# EAGLE design Wordwatch - complete (EAGLE 8.0.1)
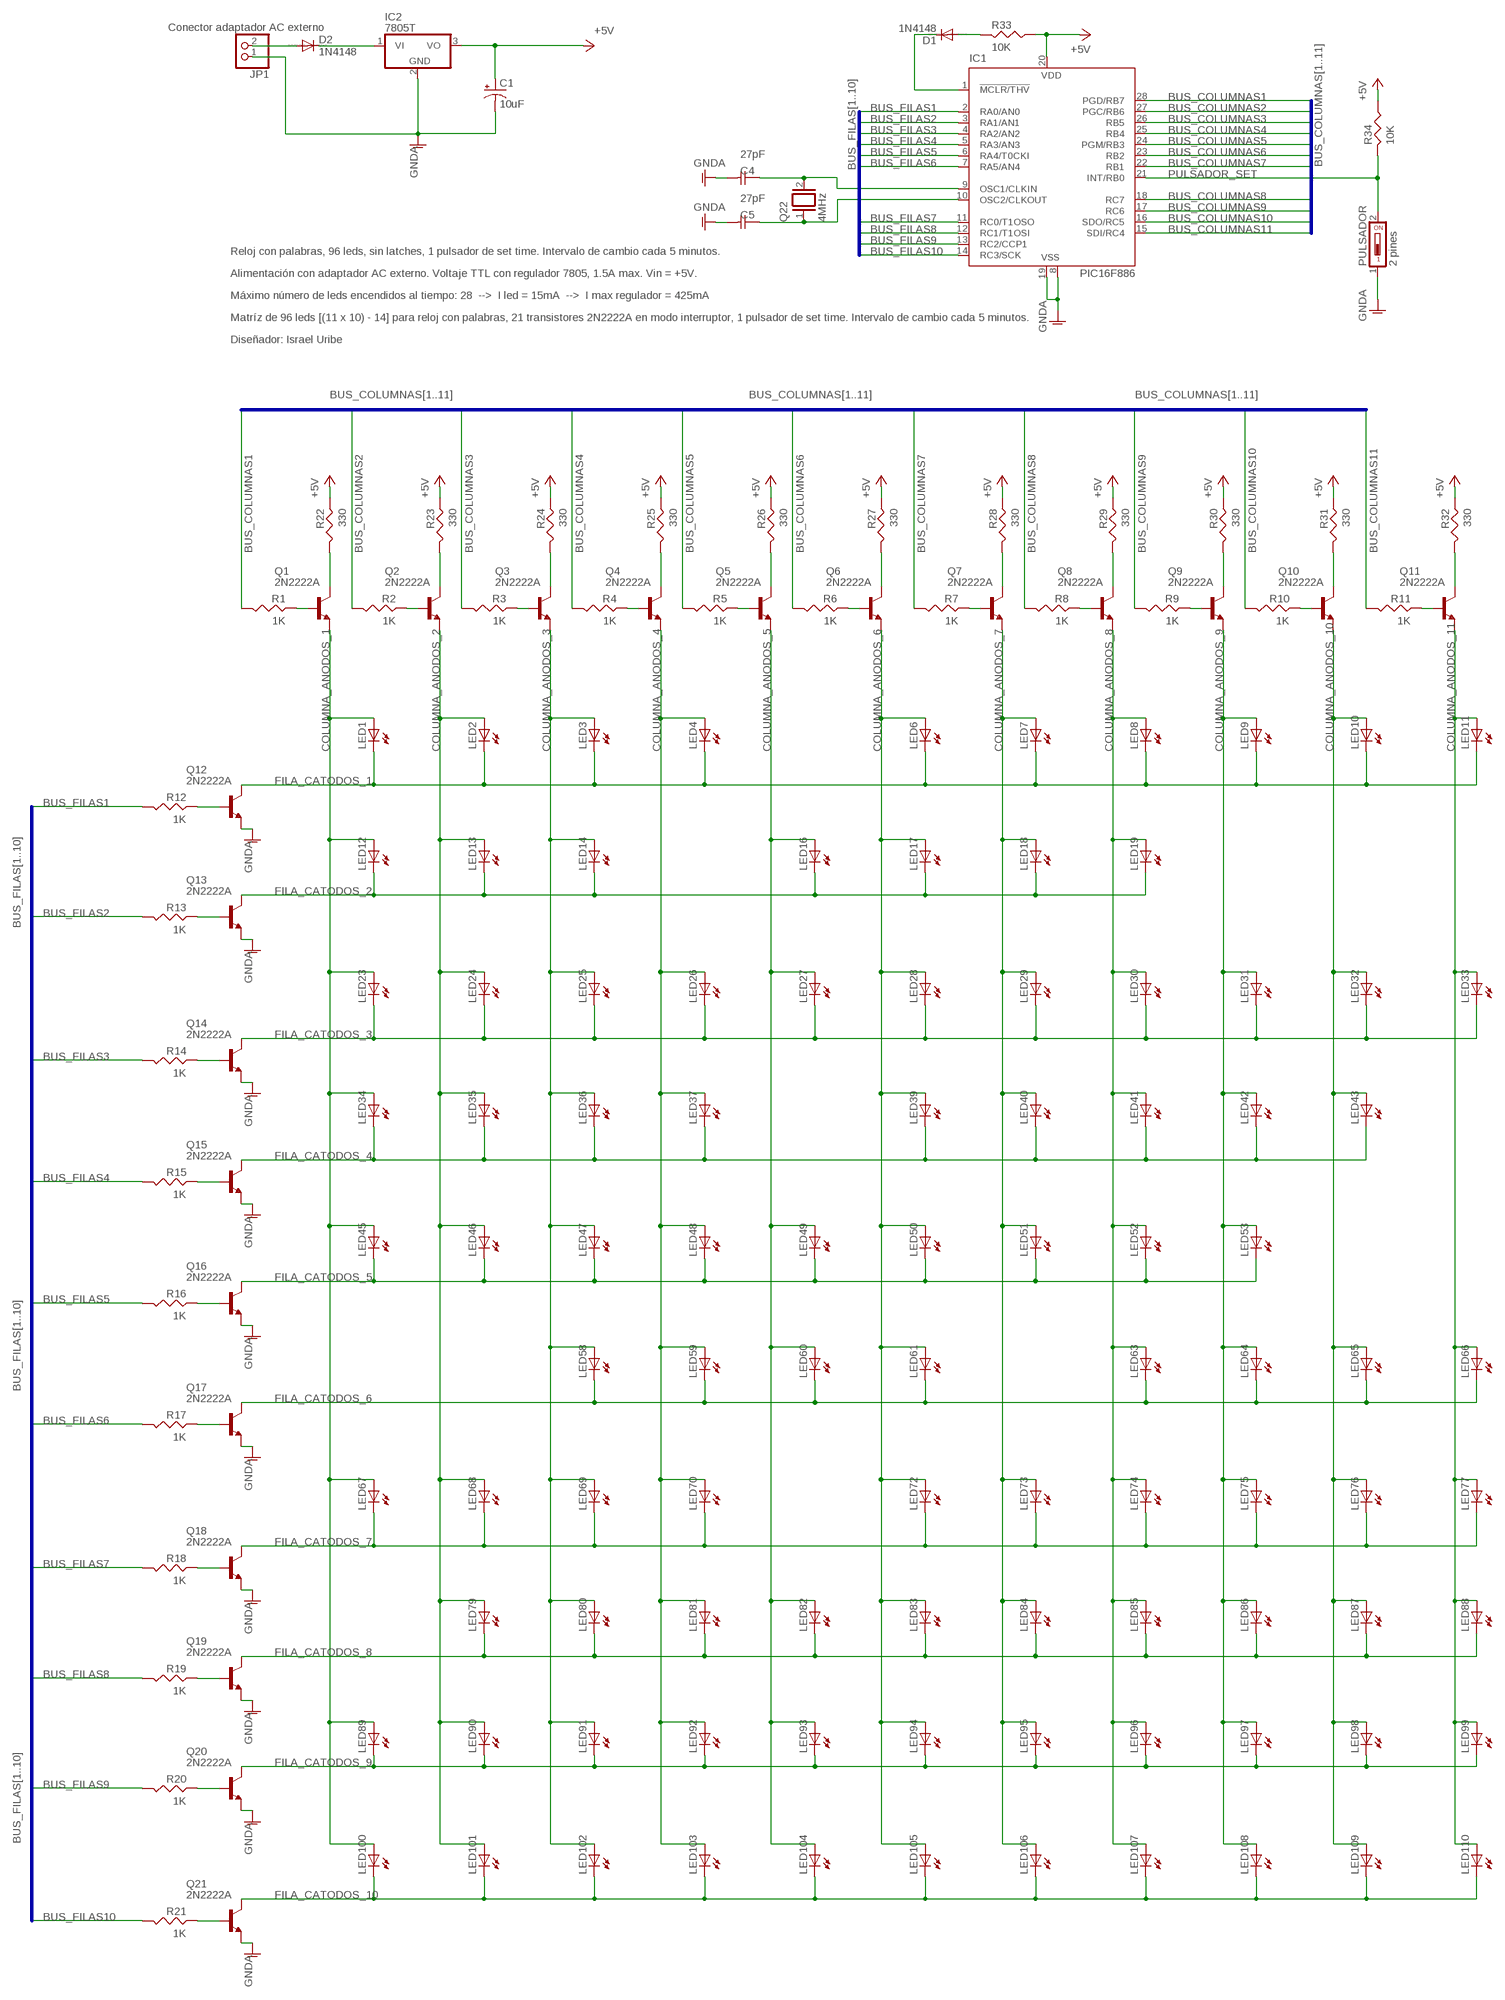
[diagram p0: schematic, sheet 1]

## Parts
C1  10uF  CPOL-USE2-4  [E2-4]
C4  27pF  CAPNP-2,5  [C-2,5]
C5  27pF  CAPNP-2,5  [C-2,5]
D1  1N4148  DIODE-D-7.5  [D-7.5]
D2  1N4148  DIODE-D-7.5  [D-7.5]
IC1  PIC16F886  PIC16876P  [DIL28-3]
IC2  7805T  [TO220H]
JP1  Conector adaptador AC externo  PINHD-1X2  [1X02]
LED1  LED3MM  [LED3MM]
LED2  LED3MM  [LED3MM]
LED3  LED3MM  [LED3MM]
LED4  LED3MM  [LED3MM]
LED6  LED3MM  [LED3MM]
LED7  LED3MM  [LED3MM]
LED8  LED3MM  [LED3MM]
LED9  LED3MM  [LED3MM]
LED10  LED3MM  [LED3MM]
LED11  LED3MM  [LED3MM]
LED12  LED3MM  [LED3MM]
LED13  LED3MM  [LED3MM]
LED14  LED3MM  [LED3MM]
LED16  LED3MM  [LED3MM]
LED17  LED3MM  [LED3MM]
LED18  LED3MM  [LED3MM]
LED19  LED3MM  [LED3MM]
LED23  LED3MM  [LED3MM]
LED24  LED3MM  [LED3MM]
LED25  LED3MM  [LED3MM]
LED26  LED3MM  [LED3MM]
LED27  LED3MM  [LED3MM]
LED28  LED3MM  [LED3MM]
LED29  LED3MM  [LED3MM]
LED30  LED3MM  [LED3MM]
LED31  LED3MM  [LED3MM]
LED32  LED3MM  [LED3MM]
LED33  LED3MM  [LED3MM]
LED34  LED3MM  [LED3MM]
LED35  LED3MM  [LED3MM]
LED36  LED3MM  [LED3MM]
LED37  LED3MM  [LED3MM]
LED39  LED3MM  [LED3MM]
LED40  LED3MM  [LED3MM]
LED41  LED3MM  [LED3MM]
LED42  LED3MM  [LED3MM]
LED43  LED3MM  [LED3MM]
LED45  LED3MM  [LED3MM]
LED46  LED3MM  [LED3MM]
LED47  LED3MM  [LED3MM]
LED48  LED3MM  [LED3MM]
LED49  LED3MM  [LED3MM]
LED50  LED3MM  [LED3MM]
LED51  LED3MM  [LED3MM]
LED52  LED3MM  [LED3MM]
LED53  LED3MM  [LED3MM]
LED58  LED3MM  [LED3MM]
LED59  LED3MM  [LED3MM]
LED60  LED3MM  [LED3MM]
LED61  LED3MM  [LED3MM]
LED63  LED3MM  [LED3MM]
LED64  LED3MM  [LED3MM]
LED65  LED3MM  [LED3MM]
LED66  LED3MM  [LED3MM]
LED67  LED3MM  [LED3MM]
LED68  LED3MM  [LED3MM]
LED69  LED3MM  [LED3MM]
LED70  LED3MM  [LED3MM]
LED72  LED3MM  [LED3MM]
LED73  LED3MM  [LED3MM]
LED74  LED3MM  [LED3MM]
LED75  LED3MM  [LED3MM]
LED76  LED3MM  [LED3MM]
LED77  LED3MM  [LED3MM]
LED79  LED3MM  [LED3MM]
LED80  LED3MM  [LED3MM]
LED81  LED3MM  [LED3MM]
LED82  LED3MM  [LED3MM]
LED83  LED3MM  [LED3MM]
LED84  LED3MM  [LED3MM]
LED85  LED3MM  [LED3MM]
LED86  LED3MM  [LED3MM]
LED87  LED3MM  [LED3MM]
LED88  LED3MM  [LED3MM]
LED89  LED3MM  [LED3MM]
LED90  LED3MM  [LED3MM]
LED91  LED3MM  [LED3MM]
LED92  LED3MM  [LED3MM]
LED93  LED3MM  [LED3MM]
LED94  LED3MM  [LED3MM]
LED95  LED3MM  [LED3MM]
LED96  LED3MM  [LED3MM]
LED97  LED3MM  [LED3MM]
LED98  LED3MM  [LED3MM]
LED99  LED3MM  [LED3MM]
LED100  LED3MM  [LED3MM]
LED101  LED3MM  [LED3MM]
LED102  LED3MM  [LED3MM]
LED103  LED3MM  [LED3MM]
LED104  LED3MM  [LED3MM]
LED105  LED3MM  [LED3MM]
LED106  LED3MM  [LED3MM]
LED107  LED3MM  [LED3MM]
LED108  LED3MM  [LED3MM]
LED109  LED3MM  [LED3MM]
LED110  LED3MM  [LED3MM]
PULSADOR  2 pines  DS01  [DS-01]
Q1  2N2222A  2N4124-NPN-TO92-CBE  [TO92-CBE]
Q2  2N2222A  2N4124-NPN-TO92-CBE  [TO92-CBE]
Q3  2N2222A  2N4124-NPN-TO92-CBE  [TO92-CBE]
Q4  2N2222A  2N4124-NPN-TO92-CBE  [TO92-CBE]
Q5  2N2222A  2N4124-NPN-TO92-CBE  [TO92-CBE]
Q6  2N2222A  2N4124-NPN-TO92-CBE  [TO92-CBE]
Q7  2N2222A  2N4124-NPN-TO92-CBE  [TO92-CBE]
Q8  2N2222A  2N4124-NPN-TO92-CBE  [TO92-CBE]
Q9  2N2222A  2N4124-NPN-TO92-CBE  [TO92-CBE]
Q10  2N2222A  2N4124-NPN-TO92-CBE  [TO92-CBE]
Q11  2N2222A  2N4124-NPN-TO92-CBE  [TO92-CBE]
Q12  2N2222A  2N4124-NPN-TO92-CBE  [TO92-CBE]
Q13  2N2222A  2N4124-NPN-TO92-CBE  [TO92-CBE]
Q14  2N2222A  2N4124-NPN-TO92-CBE  [TO92-CBE]
Q15  2N2222A  2N4124-NPN-TO92-CBE  [TO92-CBE]
Q16  2N2222A  2N4124-NPN-TO92-CBE  [TO92-CBE]
Q17  2N2222A  2N4124-NPN-TO92-CBE  [TO92-CBE]
Q18  2N2222A  2N4124-NPN-TO92-CBE  [TO92-CBE]
Q19  2N2222A  2N4124-NPN-TO92-CBE  [TO92-CBE]
Q20  2N2222A  2N4124-NPN-TO92-CBE  [TO92-CBE]
Q21  2N2222A  2N4124-NPN-TO92-CBE  [TO92-CBE]
Q22  4MHz  XTAL/S  [QS]
R1  1K  RESUS-5  [R-5]
R2  1K  RESUS-5  [R-5]
R3  1K  RESUS-5  [R-5]
R4  1K  RESUS-5  [R-5]
R5  1K  RESUS-5  [R-5]
R6  1K  RESUS-5  [R-5]
R7  1K  RESUS-5  [R-5]
R8  1K  RESUS-5  [R-5]
R9  1K  RESUS-5  [R-5]
R10  1K  RESUS-5  [R-5]
R11  1K  RESUS-5  [R-5]
R12  1K  RESUS-5  [R-5]
R13  1K  RESUS-5  [R-5]
R14  1K  RESUS-5  [R-5]
R15  1K  RESUS-5  [R-5]
R16  1K  RESUS-5  [R-5]
R17  1K  RESUS-5  [R-5]
R18  1K  RESUS-5  [R-5]
R19  1K  RESUS-5  [R-5]
R20  1K  RESUS-5  [R-5]
R21  1K  RESUS-5  [R-5]
R22  330  RESUS-5  [R-5]
R23  330  RESUS-5  [R-5]
R24  330  RESUS-5  [R-5]
R25  330  RESUS-5  [R-5]
R26  330  RESUS-5  [R-5]
R27  330  RESUS-5  [R-5]
R28  330  RESUS-5  [R-5]
R29  330  RESUS-5  [R-5]
R30  330  RESUS-5  [R-5]
R31  330  RESUS-5  [R-5]
R32  330  RESUS-5  [R-5]
R33  10K  RESUS-5  [R-5]
R34  10K  RESUS-5  [R-5]

## Nets
+5V: C1.+ IC1.20(VDD) IC2.3(VO) R22.2 R23.2 R24.2 R25.2 R26.2 R27.2 R28.2 R29.2 R30.2 R31.2 R32.2 R33.1 R34.1
BUS_COLUMNAS1: IC1.28(PGD/RB7) R1.1
BUS_COLUMNAS2: IC1.27(PGC/RB6) R2.1
BUS_COLUMNAS3: IC1.26(RB5) R3.1
BUS_COLUMNAS4: IC1.25(RB4) R4.1
BUS_COLUMNAS5: IC1.24(PGM/RB3) R5.1
BUS_COLUMNAS6: IC1.23(RB2) R6.1
BUS_COLUMNAS7: IC1.22(RB1) R7.1
BUS_COLUMNAS8: IC1.18(RC7) R8.1
BUS_COLUMNAS9: IC1.17(RC6) R9.1
BUS_COLUMNAS10: IC1.16(SDO/RC5) R10.1
BUS_COLUMNAS11: IC1.15(SDI/RC4) R11.1
BUS_FILAS1: IC1.2(RA0/AN0) R12.1
BUS_FILAS2: IC1.3(RA1/AN1) R13.1
BUS_FILAS3: IC1.4(RA2/AN2) R14.1
BUS_FILAS4: IC1.5(RA3/AN3) R15.1
BUS_FILAS5: IC1.6(RA4/T0CKI) R16.1
BUS_FILAS6: IC1.7(RA5/AN4) R17.1
BUS_FILAS7: IC1.11(RC0/T1OSO) R18.1
BUS_FILAS8: IC1.12(RC1/T1OSI) R19.1
BUS_FILAS9: IC1.13(RC2/CCP1) R20.1
BUS_FILAS10: IC1.14(RC3/SCK) R21.1
COLUMNA_ANODOS_1: LED1.A LED12.A LED23.A LED34.A LED45.A LED67.A LED89.A LED100.A Q1.E
COLUMNA_ANODOS_2: LED2.A LED13.A LED24.A LED35.A LED46.A LED68.A LED79.A LED90.A LED101.A Q2.E
COLUMNA_ANODOS_3: LED3.A LED14.A LED25.A LED36.A LED47.A LED58.A LED69.A LED80.A LED91.A LED102.A Q3.E
COLUMNA_ANODOS_4: LED4.A LED26.A LED37.A LED48.A LED59.A LED70.A LED81.A LED92.A LED103.A Q4.E
COLUMNA_ANODOS_5: LED16.A LED27.A LED49.A LED60.A LED82.A LED93.A LED104.A Q5.E
COLUMNA_ANODOS_6: LED6.A LED17.A LED28.A LED39.A LED50.A LED61.A LED72.A LED83.A LED94.A LED105.A Q6.E
COLUMNA_ANODOS_7: LED7.A LED18.A LED29.A LED40.A LED51.A LED73.A LED84.A LED95.A LED106.A Q7.E
COLUMNA_ANODOS_8: LED8.A LED19.A LED30.A LED41.A LED52.A LED63.A LED74.A LED85.A LED96.A LED107.A Q8.E
COLUMNA_ANODOS_9: LED9.A LED31.A LED42.A LED53.A LED64.A LED75.A LED86.A LED97.A LED108.A Q9.E
COLUMNA_ANODOS_10: LED10.A LED32.A LED43.A LED65.A LED76.A LED87.A LED98.A LED109.A Q10.E
COLUMNA_ANODOS_11: LED11.A LED33.A LED66.A LED77.A LED88.A LED99.A LED110.A Q11.E
FILA_CATODOS_1: LED1.K(C) LED2.K(C) LED3.K(C) LED4.K(C) LED6.K(C) LED7.K(C) LED8.K(C) LED9.K(C) LED10.K(C) LED11.K(C) Q12.C
FILA_CATODOS_2: LED12.K(C) LED13.K(C) LED14.K(C) LED16.K(C) LED17.K(C) LED18.K(C) LED19.K(C) Q13.C
FILA_CATODOS_3: LED23.K(C) LED24.K(C) LED25.K(C) LED26.K(C) LED27.K(C) LED28.K(C) LED29.K(C) LED30.K(C) LED31.K(C) LED32.K(C) LED33.K(C) Q14.C
FILA_CATODOS_4: LED34.K(C) LED35.K(C) LED36.K(C) LED37.K(C) LED39.K(C) LED40.K(C) LED41.K(C) LED42.K(C) LED43.K(C) Q15.C
FILA_CATODOS_5: LED45.K(C) LED46.K(C) LED47.K(C) LED48.K(C) LED49.K(C) LED50.K(C) LED51.K(C) LED52.K(C) LED53.K(C) Q16.C
FILA_CATODOS_6: LED58.K(C) LED59.K(C) LED60.K(C) LED61.K(C) LED63.K(C) LED64.K(C) LED65.K(C) LED66.K(C) Q17.C
FILA_CATODOS_7: LED67.K(C) LED68.K(C) LED69.K(C) LED70.K(C) LED72.K(C) LED73.K(C) LED74.K(C) LED75.K(C) LED76.K(C) LED77.K(C) Q18.C
FILA_CATODOS_8: LED79.K(C) LED80.K(C) LED81.K(C) LED82.K(C) LED83.K(C) LED84.K(C) LED85.K(C) LED86.K(C) LED87.K(C) LED88.K(C) Q19.C
FILA_CATODOS_9: LED89.K(C) LED90.K(C) LED91.K(C) LED92.K(C) LED93.K(C) LED94.K(C) LED95.K(C) LED96.K(C) LED97.K(C) LED98.K(C) LED99.K(C) Q20.C
FILA_CATODOS_10: LED100.K(C) LED101.K(C) LED102.K(C) LED103.K(C) LED104.K(C) LED105.K(C) LED106.K(C) LED107.K(C) LED108.K(C) LED109.K(C) LED110.K(C) Q21.C
GNDA [ground]: C1.- C4.2 C5.2 IC1.8(VSS) IC1.19(VSS) IC2.2(GND) JP1.1 PULSADOR.1 Q12.E Q13.E Q14.E Q15.E Q16.E Q17.E Q18.E Q19.E Q20.E Q21.E
N$1: Q11.C R32.1
N$2: Q10.C R31.1
N$3: Q9.C R30.1
N$4: Q8.C R29.1
N$6: Q7.C R28.1
N$7: Q6.C R27.1
N$8: Q5.C R26.1
N$9: Q4.C R25.1
N$10: Q3.C R24.1
N$11: Q2.C R23.1
N$12: Q1.C R22.1
N$13: Q1.B R1.2
N$14: Q2.B R2.2
N$16: Q3.B R3.2
N$17: Q4.B R4.2
N$18: Q5.B R5.2
N$19: Q6.B R6.2
N$23: Q7.B R7.2
N$24: Q8.B R8.2
N$25: Q9.B R9.2
N$26: Q10.B R10.2
N$27: Q11.B R11.2
N$28: Q12.B R12.2
N$29: Q13.B R13.2
N$30: Q14.B R14.2
N$31: Q15.B R15.2
N$32: Q16.B R16.2
N$33: Q17.B R17.2
N$34: Q18.B R18.2
N$35: Q19.B R19.2
N$36: Q20.B R20.2
N$37: Q21.B R21.2
N$50: C4.1 IC1.9(OSC1/CLKIN) Q22.2
N$77: D1.A R33.2
N$78: C5.1 IC1.10(OSC2/CLKOUT) Q22.1
N$79: D1.C IC1.1(!MCLR/THV)
N$80: D2.A JP1.2
N$81: D2.C IC2.1(VI)
PULSADOR_SET: IC1.21(INT/RB0) PULSADOR.2 R34.2

## Buses
BUS_COLUMNAS[1..11]
BUS_FILAS[1..10]

## Notes on the sheet
- Reloj con palabras, 96 leds, sin latches, 1 pulsador de set time. Intervalo de cambio cada 5 minutos.
- Alimentación con adaptador AC externo. Voltaje TTL con regulador 7805, 1.5A max. Vin = +5V.
- Máximo número de leds encendidos al tiempo: 28  -->  I led = 15mA  -->  I max regulador = 425mA
- Matríz de 96 leds [(11 x 10) - 14] para reloj con palabras, 21 transistores 2N2222A en modo interruptor, 1 pulsador de set time. Intervalo de cambio cada 5 minutos.
- Diseñador: Israel Uribe

## Library data of the parts
C1 = rcl:CPOL-US: POLARIZED CAPACITOR, American symbol
C4 C5 = discrete:CAPNP-2,5
D1 D2 = diode:DIODE-: DIODE
IC1 = microchip:PIC16*876: MICROCONTROLLER flash type; OC_FARNELL: unknown; OC_NEWARK: unknown
IC2 = linear:78*: Positive VOLTAGE REGULATOR Source: http://cache.national.com/ds/LM/LM78L05.pdf http://www.fairchildsemi.com/ds/LM/LM7805.pdf
JP1 = pinhead:PINHD-1X2: PIN HEADER
LED1-LED4 LED6-LED14 LED16-LED19 LED23-LED37 LED39-LED43 LED45-LED53 LED58-LED61 LED63-LED70 LED72-LED77 LED79-LED110 = led:LED: LED OSRAM: - CHIPLED LG R971, LG N971, LY N971, LG Q971, LY Q971, LO R971, LY R971 LH N974, LH R974 LS Q976, LO Q976, LY Q976 LO Q996 - Hyper CHIPLED LW Q18S LB Q993, LB Q99A, LB R99A - SideLED LS A670, LO A670, LY A670, LG A670, LP A670 LB A673, LV A673, LT A673, LW A673 LH A674 LY A675 LS A676, LA A676, LO A676, LY A676, LW A676 LS A679, LY A679, LG A679 - Hyper Micro SIDELED® LS Y876, LA Y876, LO Y876, LY Y876 LT Y87S - SmartLED LW L88C, LW L88S LB L89C, LB L89S, LG L890 LS L89K, LO L89K, LY L89K LS L896, LA L896, LO L896, LY L896 - TOPLED LS T670, LO T670, LY T670, LG T670, LP T670 LSG T670, LSP T670, LSY T670, LOP T670, LYG T670 LG T671, LOG T671, LSG T671 LB T673, LV T673, LT T673, LW T673 LH T674 LS T676, LA T676, LO T676, LY T676, LB T676, LH T676, LSB T676, LW T676 LB T67C, LV T67C, LT T67C, LS T67K, LO T67K, LY T67K, LW E67C LS E67B, LA E67B, LO E67B, LY E67B, LB E67C, LV E67C, LT E67C LW T67C LS T679, LY T679, LG T679 LS T770, LO T770, LY T770, LG T770, LP T770 LB T773, LV T773, LT T773, LW T773 LH T774 LS E675, LA E675, LY E675, LS T675 LS T776, LA T776, LO T776, LY T776, LB T776 LHGB T686 LT T68C, LB T68C - Hyper Mini TOPLED® LB M676 - Mini TOPLED Santana® LG M470 LS M47K, LO M47K, LY M47K Source: http://www.osram.convergy.de LUXEON: - LUMILED® LXK2-PW12-R00, LXK2-PW12-S00, LXK2-PW14-U00, LXK2-PW14-V00 LXK2-PM12-R00, LXK2-PM12-S00, LXK2-PM14-U00 LXK2-PE12-Q00, LXK2-PE12-R00, LXK2-PE12-S00, LXK2-PE14-T00, LXK2-PE14-U00 LXK2-PB12-K00, LXK2-PB12-L00, LXK2-PB12-M00, LXK2-PB14-N00, LXK2-PB14-P00, LXK2-PB14-Q00 LXK2-PR12-L00, LXK2-PR12-M00, LXK2-PR14-Q00, LXK2-PR14-R00 LXK2-PD12-Q00, LXK2-PD12-R00, LXK2-PD12-S00 LXK2-PH12-R00, LXK2-PH12-S00 LXK2-PL12-P00, LXK2-PL12-Q00, LXK2-PL12-R00 Source: www.luxeon.com KINGBRIGHT: KA-3528ASYC Source: www.kingbright.com
PULSADOR = switch-dil:DS01: DIL/CODE SWITCH; OC_FARNELL: unknown; OC_NEWARK: unknown
Q1-Q21 = transistor:*-NPN-: NPN Transistror BF959 corrected 2008.03.06
Q22 = special:XTAL/S: CRYSTAL
R1-R34 = discrete:RESUS-5

## Net classes
0 default: width 3.048 mm, clearance 0.254 mm
1 ground: width 3.048 mm, clearance 0.254 mm
2 source: width 3.048 mm, clearance 0.254 mm

## Board
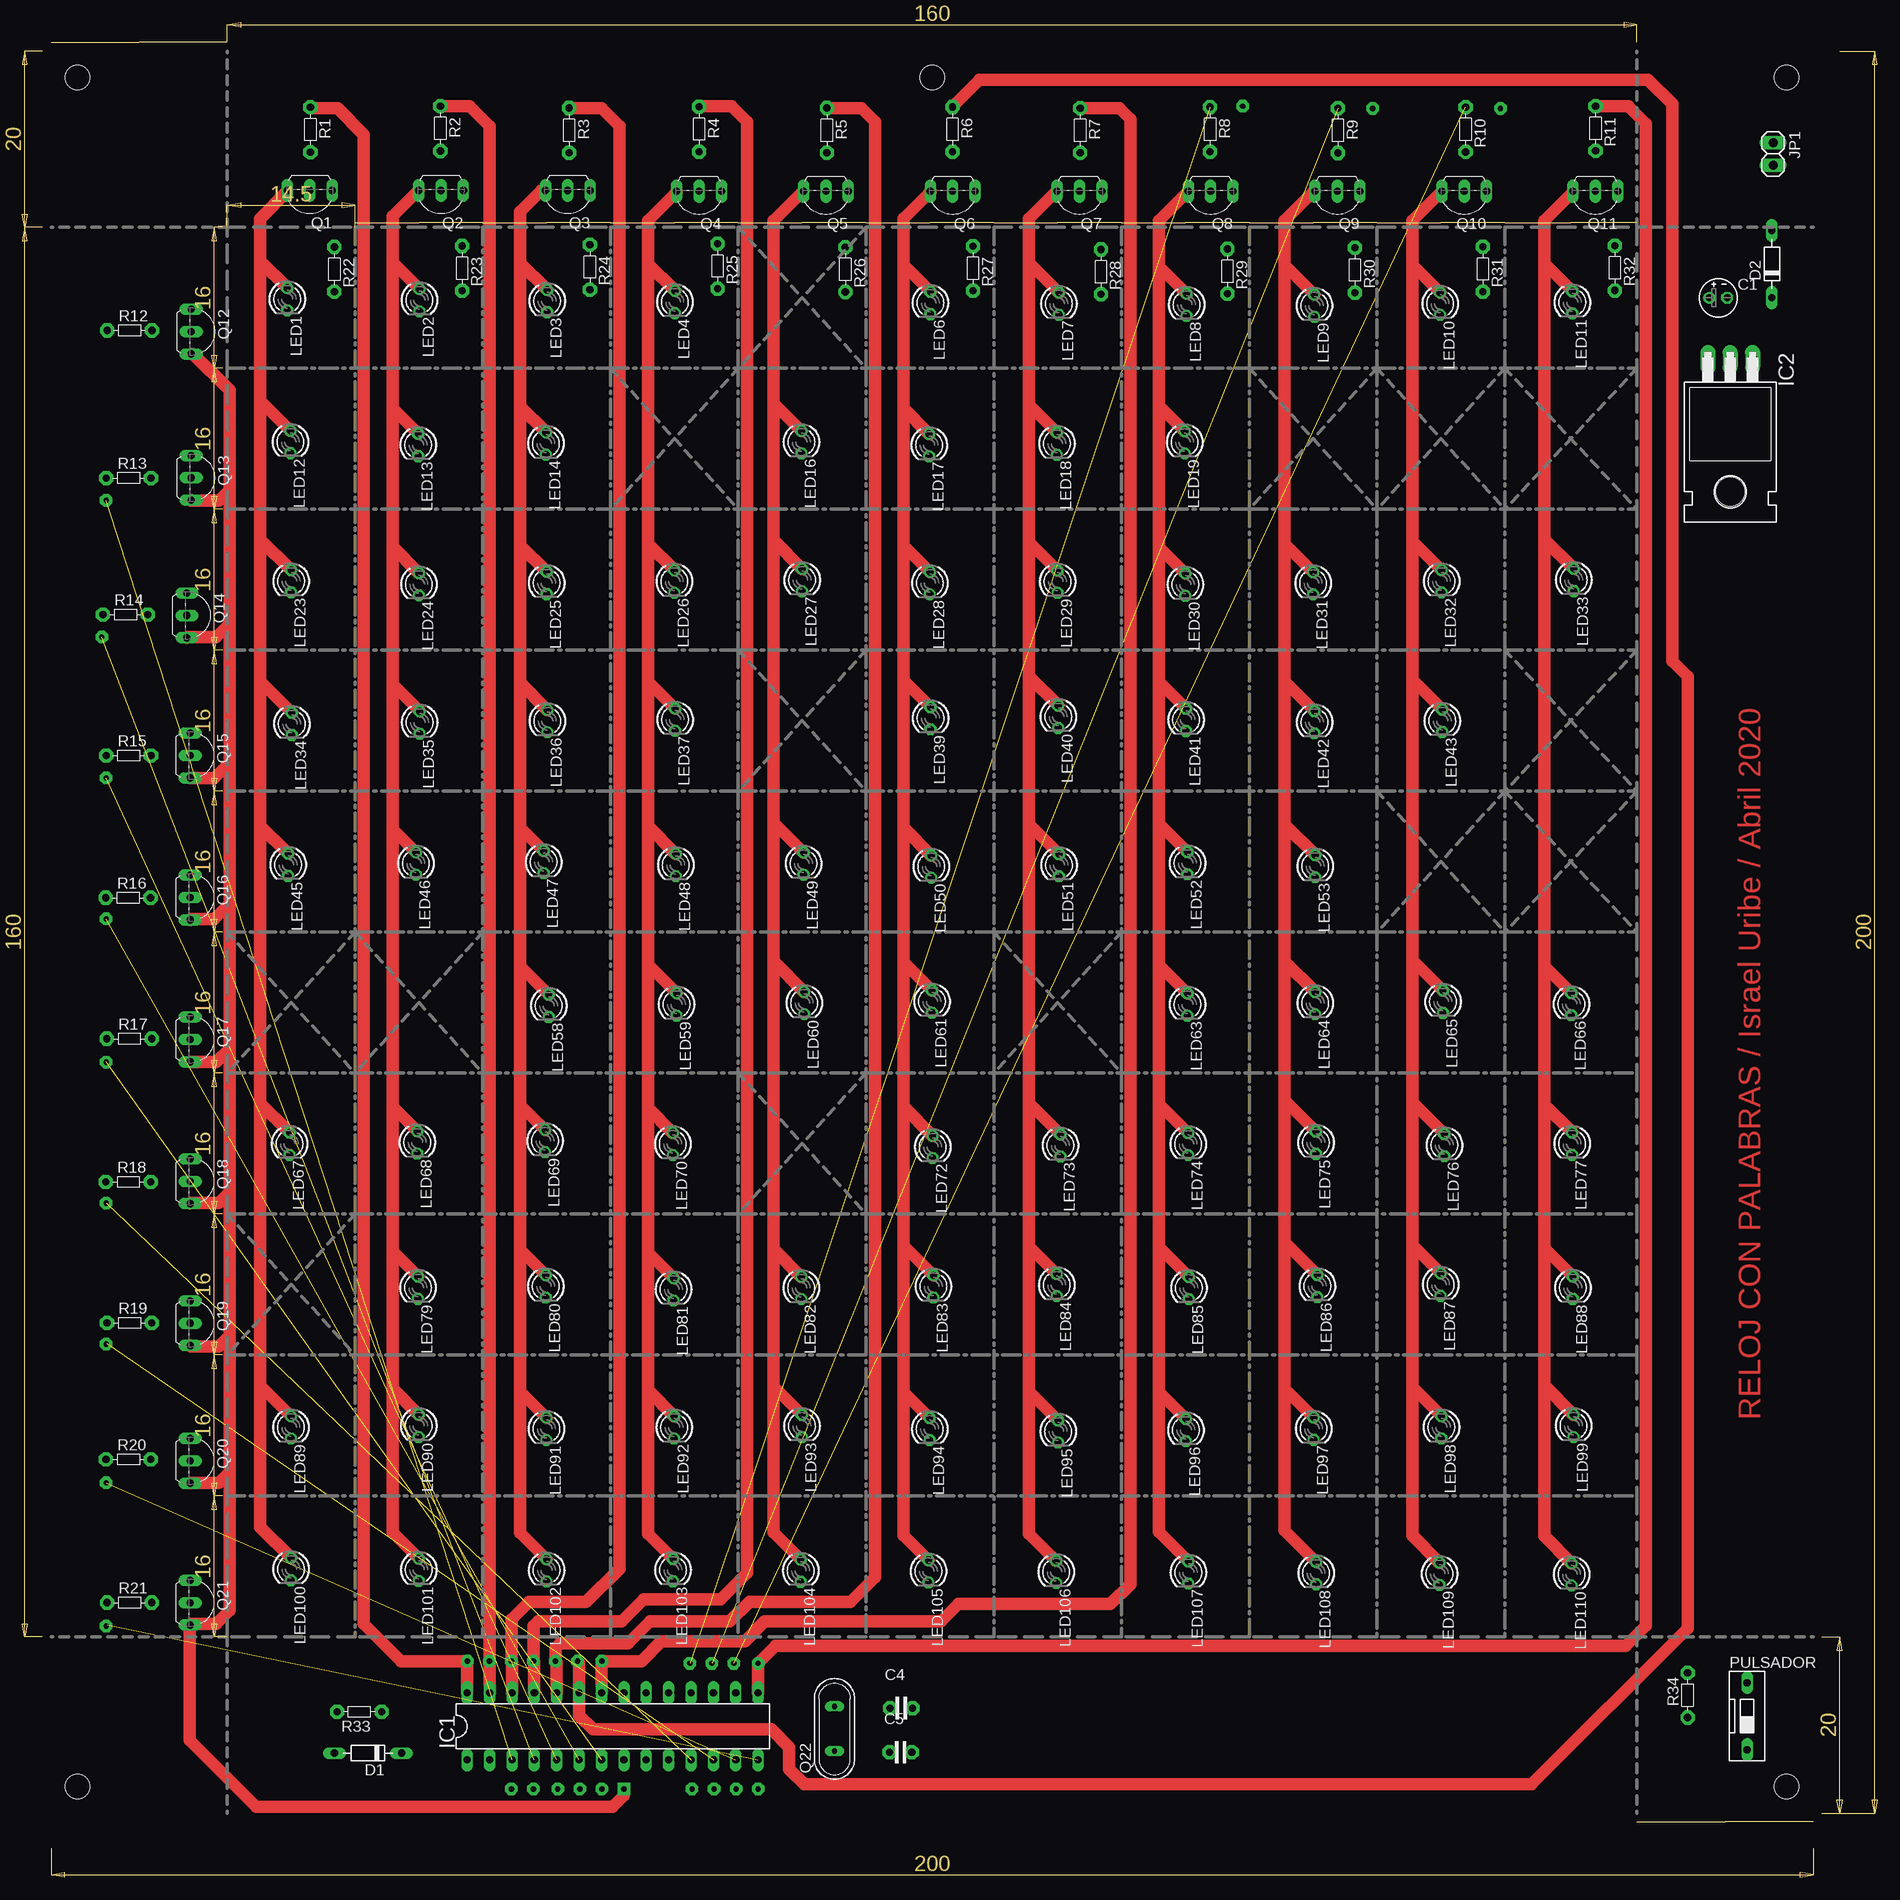
[diagram p1: board, top side]
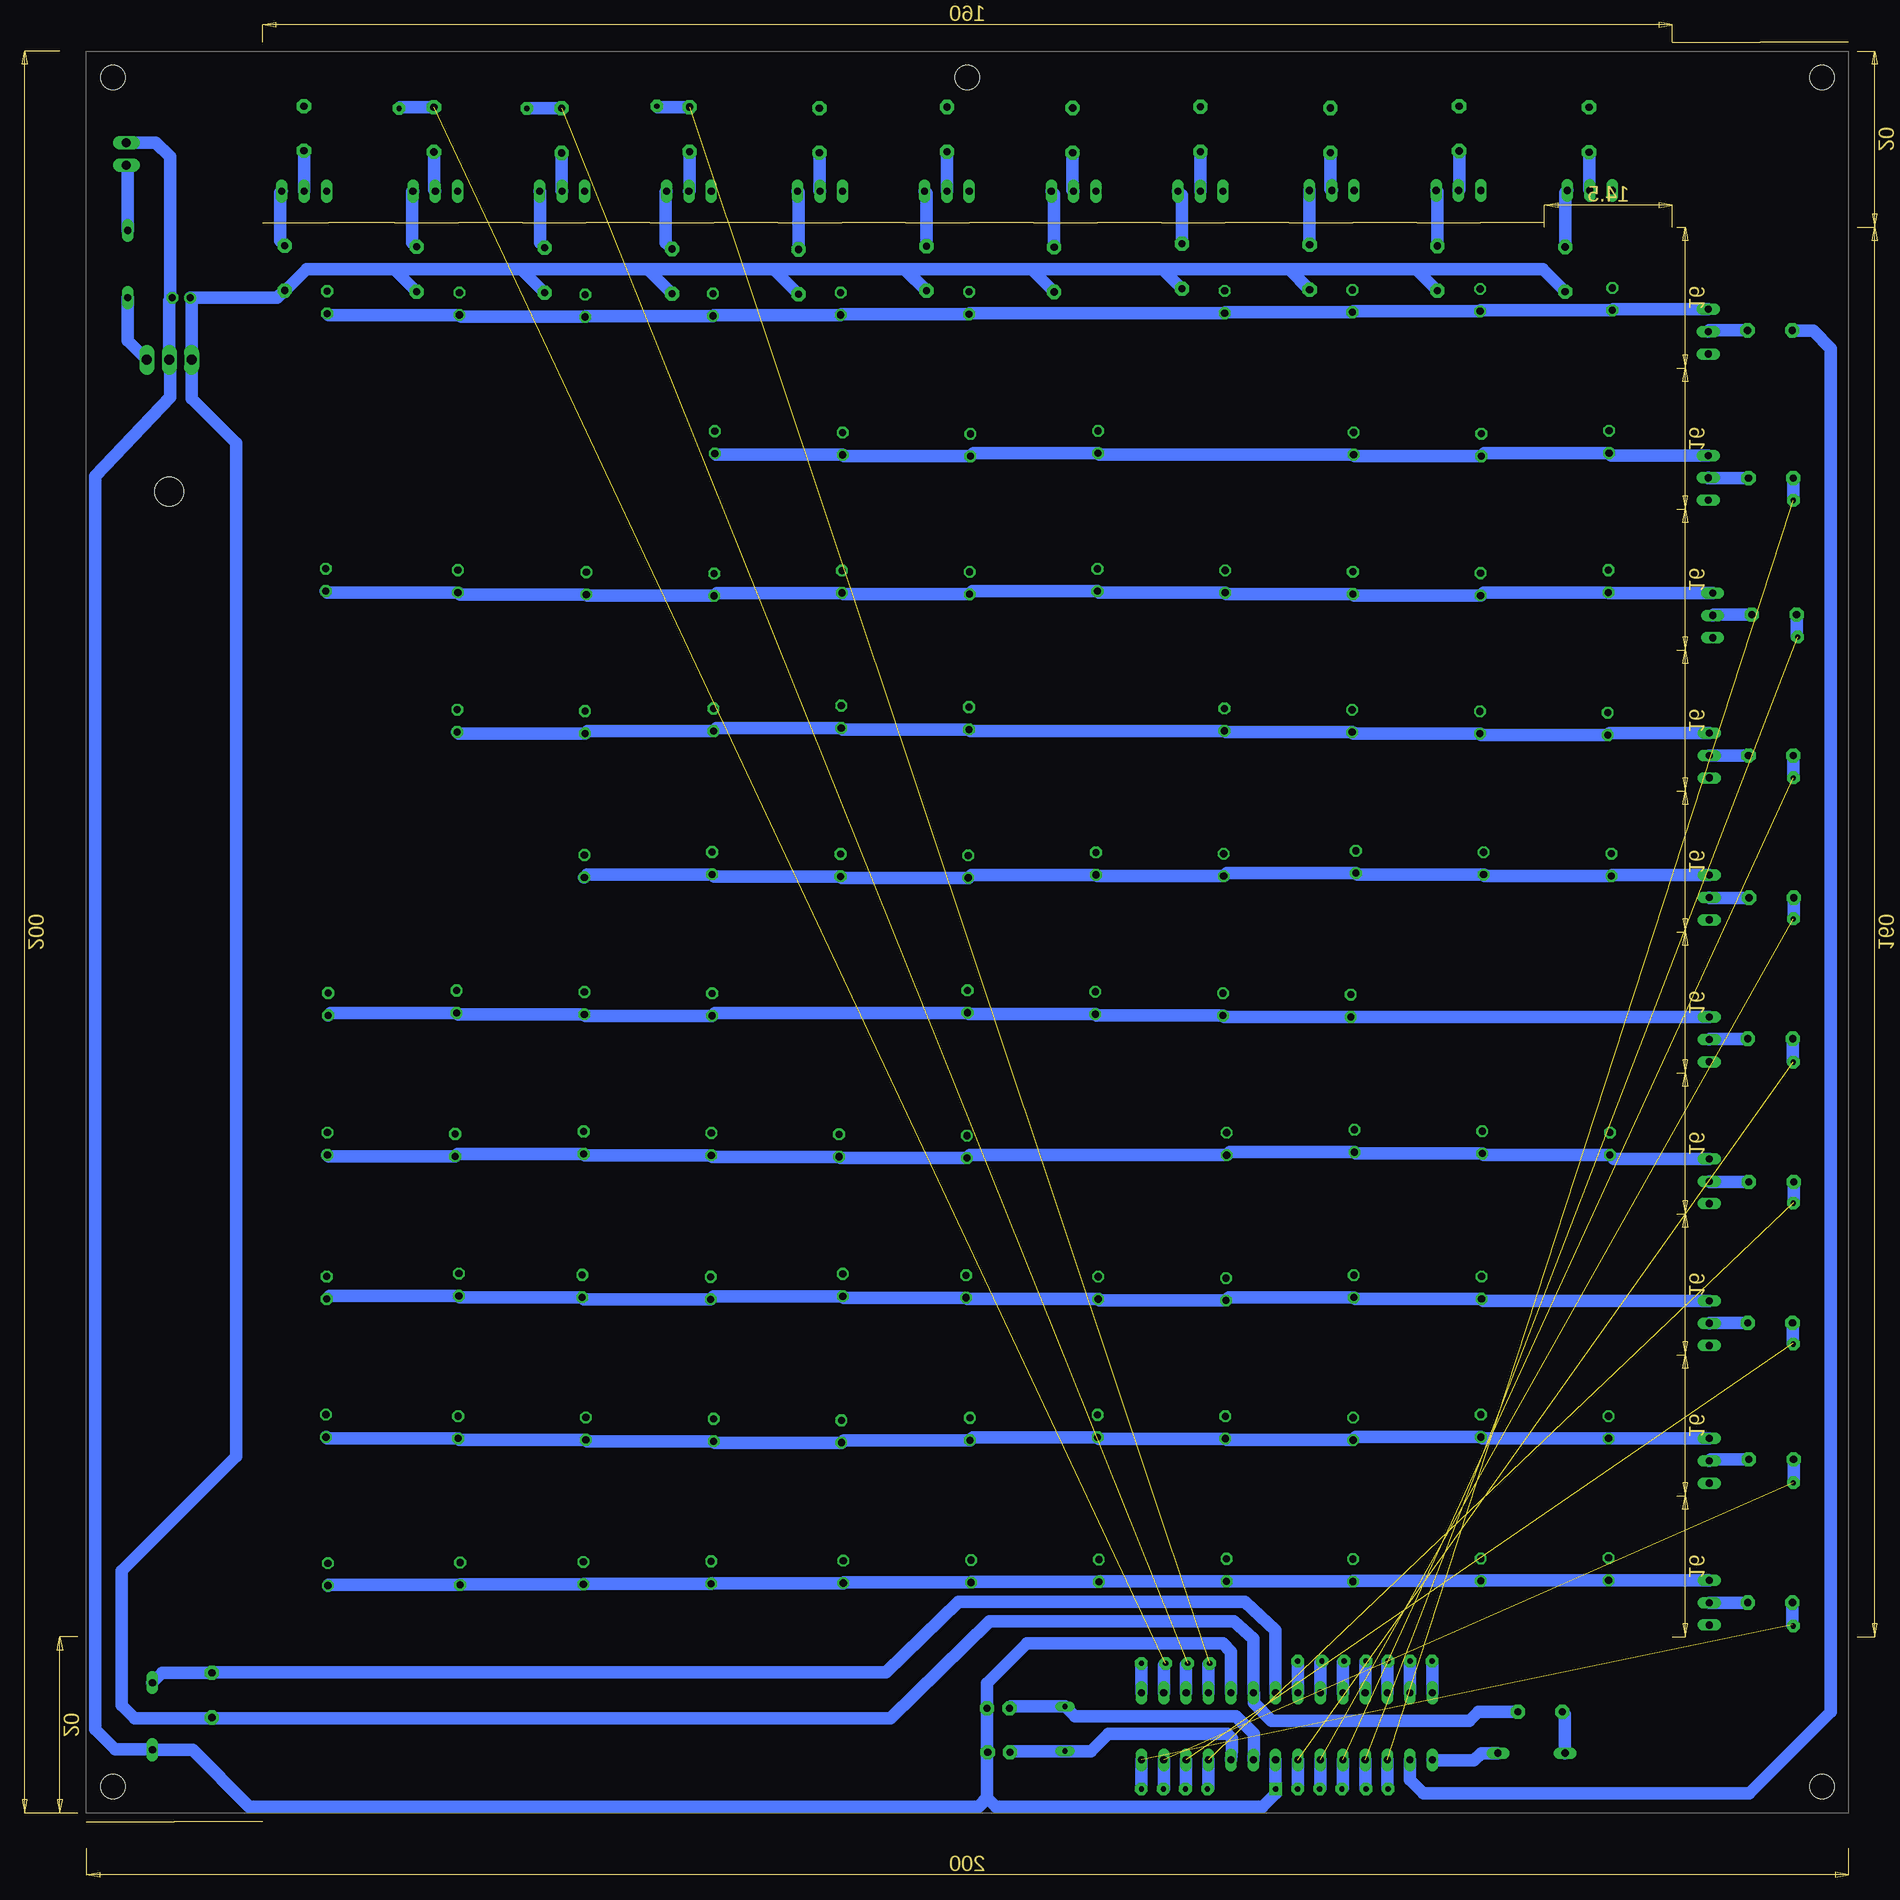
[diagram p2: board, bottom side, seen from below]

Size 210.6 x 210.6 mm. Coordinates in mm from the lower left corner, seen from the top.
Copper layers (1*16): Top 0.035mm / dielectric 1.5mm / Bottom 0.035mm
Design rules "default": minimum track width 10mil, minimum drill 24mil, track to track 8mil, track to pad 8mil, pad to pad 8mil, via to via 8mil, smd to smd 8mil, copper to edge 40mil, drill to drill 8mil, minimum pad ring 10mil, minimum via ring 8mil, stop-mask expansion 4mil, vias tented up to drill 0mil, thermal gap 10mil
Holes 2.8 mm at 6.3,10.3 200.3,10.3 200.3,204.3 6.3,204.3 103.3,204.3

### Footprints (pad centres in the part's own frame; a part is rotated, then mirrored left to right if it is on the bottom)
E2-4 = drill 0.813 pad 1.27: + -1.016,0 | drill 0.813 pad 1.27 octagon: - 1.016,0
C-2,5 = drill 0.813 pad 1.6 octagon: 1 -1.27,0; 2 1.27,0
D-7.5 = drill 0.813 long: A 3.81,0; C -3.81,0
DIL28-3 = drill 0.813 long: 1 -16.51,-3.81; 2 -13.97,-3.81; 3 -11.43,-3.81; 4 -8.89,-3.81; 5 -6.35,-3.81; 6 -3.81,-3.81; 7 -1.27,-3.81; 8 1.27,-3.81; 9 3.81,-3.81; 10 6.35,-3.81; 11 8.89,-3.81; 12 11.43,-3.81; 13 13.97,-3.81; 14 16.51,-3.81; 15 16.51,3.81; 16 13.97,3.81; 17 11.43,3.81; 18 8.89,3.81; 19 6.35,3.81; 20 3.81,3.81; 21 1.27,3.81; 22 -1.27,3.81; 23 -3.81,3.81; 24 -6.35,3.81; 25 -8.89,3.81; 26 -11.43,3.81; 27 -13.97,3.81; 28 -16.51,3.81
TO220H = drill 1.118 long: 1 -2.54,-10.16; 2 0,-10.16; 3 2.54,-10.16 | hole 3.302: 0,4.826
1X02 = drill 1.016 long: 1 -1.27,0; 2 1.27,0
LED3MM = drill 0.813 octagon: A -1.27,0; K 1.27,0
DS-01 = drill 0.813 long: 1 0,-3.81; 2 0,3.81
TO92-CBE = drill 0.813 long: B 0,0; C -2.54,0; E 2.54,0
QS = drill 0.61 long: 1 -2.54,0; 2 2.54,0
R-5 = drill 0.813 pad 1.6 octagon: 1 -2.54,0; 2 2.54,0

### Placement (x,y rotation side)
C1  192.53,179.3 0 top
C4  99.8,19.21 0 top
C5  99.72,14.21 0 top
D1  39.27,14.12 180 top
D2  198.62,183.13 90 top
IC1  67.04,17.15 0 top
IC2  193.89,162.1 180 top
JP1  198.75,195.63 270 top
LED1  30.1,179.15 270 top
LED2  45.1,179.04 270 top
LED3  59.6,178.93 270 top
LED4  74.1,178.82 270 top
LED6  103.1,178.71 270 top
LED7  117.68,178.62 270 top
LED8  132.18,178.51 270 top
LED9  146.68,178.4 270 top
LED10  160.96,178.62 270 top
LED11  175.96,178.78 270 top
LED12  30.46,162.94 270 top
LED13  44.96,162.6 270 top
LED14  59.46,162.76 270 top
LED16  88.46,162.92 270 top
LED17  102.96,162.58 270 top
LED18  117.46,162.74 270 top
LED19  131.96,162.9 270 top
LED23  30.54,147.12 270 top
LED24  45.04,146.78 270 top
LED25  59.54,146.94 270 top
LED26  74.04,147.1 270 top
LED27  88.54,147.26 270 top
LED28  103.04,146.92 270 top
LED29  117.54,147.08 270 top
LED30  132.04,146.74 270 top
LED31  146.54,146.9 270 top
LED32  161.12,147.12 270 top
LED33  176.12,147.28 270 top
LED34  30.62,130.94 270 top
LED35  45.12,131.1 270 top
LED36  59.62,131.26 270 top
LED37  74.12,131.42 270 top
LED39  103.12,131.58 270 top
LED40  117.62,131.74 270 top
LED41  132.12,131.4 270 top
LED42  146.7,131.12 270 top
LED43  161.2,131.28 270 top
LED45  30.2,114.94 270 top
LED46  44.7,115.1 270 top
LED47  59.2,115.26 270 top
LED48  74.2,114.92 270 top
LED49  88.7,115.08 270 top
LED50  103.2,114.74 270 top
LED51  117.7,114.9 270 top
LED52  132.28,115.12 270 top
LED53  146.78,114.78 270 top
LED58  59.78,98.94 270 top
LED59  74.28,99.1 270 top
LED60  88.78,99.26 270 top
LED61  103.28,99.42 270 top
LED63  132.28,99.08 270 top
LED64  146.78,99.24 270 top
LED65  161.28,99.4 270 top
LED66  175.86,99.12 270 top
LED67  30.36,83.28 270 top
LED68  44.86,83.44 270 top
LED69  59.36,83.6 270 top
LED70  73.86,83.26 270 top
LED72  103.36,82.92 270 top
LED73  117.86,83.08 270 top
LED74  132.36,83.24 270 top
LED75  146.86,83.4 270 top
LED76  161.44,83.12 270 top
LED77  175.94,83.28 270 top
LED79  44.94,66.94 270 top
LED80  59.44,67.1 270 top
LED81  73.94,66.76 270 top
LED82  88.44,66.92 270 top
LED83  103.44,67.08 270 top
LED84  117.44,67.24 270 top
LED85  132.44,66.9 270 top
LED86  147.02,67.12 270 top
LED87  161.02,67.28 270 top
LED88  176.02,66.94 270 top
LED89  30.52,51.1 270 top
LED90  45.02,51.26 270 top
LED91  59.52,50.92 270 top
LED92  74.02,51.08 270 top
LED93  88.52,51.24 270 top
LED94  103.02,50.9 270 top
LED95  117.6,50.62 270 top
LED96  132.1,50.78 270 top
LED97  146.6,50.94 270 top
LED98  161.1,51.1 270 top
LED99  176.1,51.26 270 top
LED100  30.53,35 270 top
LED101  45.03,34.93 270 top
LED102  59.53,34.86 270 top
LED103  73.88,34.89 270 top
LED104  88.38,34.82 270 top
LED105  102.88,34.75 270 top
LED106  117.38,34.68 270 top
LED107  132.38,34.61 270 top
LED108  146.88,34.54 270 top
LED109  160.88,34.47 270 top
LED110  175.88,34.4 270 top
PULSADOR  195.8,18.3 0 top
Q1  32.66,191.49 180 top
Q2  47.55,191.49 180 top
Q3  61.94,191.49 180 top
Q4  76.85,191.4 180 top
Q5  91.24,191.4 180 top
Q6  105.63,191.4 180 top
Q7  120.02,191.4 180 top
Q8  134.91,191.4 180 top
Q9  149.3,191.4 180 top
Q10  163.69,191.4 180 top
Q11  178.58,191.4 180 top
Q12  19.2,175.47 270 top
Q13  19.2,158.86 270 top
Q14  18.7,143.25 270 top
Q15  19.09,127.35 270 top
Q16  19.09,111.24 270 top
Q17  19.09,95.13 270 top
Q18  19.09,79.02 270 top
Q19  19.09,62.91 270 top
Q20  19.09,47.3 270 top
Q21  19.09,31.19 270 top
Q22  92.22,16.87 90 top
R1  32.73,198.38 270 top
R2  47.48,198.5 270 top
R3  62.1,198.31 270 top
R4  76.85,198.43 270 top
R5  91.35,198.3 270 top
R6  105.6,198.42 270 top
R7  120.1,198.29 270 top
R8  134.85,198.41 270 top
R9  149.35,198.28 270 top
R10  163.85,198.4 270 top
R11  178.6,198.52 270 top
R12  12.21,175.6 0 top
R13  12.09,158.85 0 top
R14  11.72,143.35 0 top
R15  12.1,127.35 0 top
R16  12.04,111.2 0 top
R17  12.17,95.2 0 top
R18  12.05,78.95 0 top
R19  12.18,62.95 0 top
R20  12.06,47.45 0 top
R21  12.19,31.2 0 top
R22  35.45,182.53 270 top
R23  49.95,182.65 270 top
R24  64.45,182.77 270 top
R25  78.95,182.89 270 top
R26  93.45,182.51 270 top
R27  107.95,182.63 270 top
R28  122.45,182.25 270 top
R29  136.8,182.31 270 top
R30  151.3,182.43 270 top
R31  165.8,182.55 270 top
R32  180.8,182.67 270 top
R33  38.29,18.8 180 top
R34  189.05,20.69 90 top

### Tracks (layer width: path | path; a pad name or v marks a point on that pad's centre or on a via)
+5V
  Bottom 1.422: R33.1 45.3,18.8 46.3,17.8 68.8,17.8 70.8,19.8 70.8,20.91 IC1.20 70.85,27.1 73.05,29.05 100.8,29.05 112.05,18.05 188.95,18.05 R34.1 189.15,18.05 197.8,18.05 199.3,19.55 199.3,34.8 186.3,47.8 186.3,162.8 191.35,167.85 IC2.3 191.35,179.14 C1.+ 181.63,179.3 R32.2 180.72,180.13 178.3,182.55 168.34,182.55 | 168.34,182.55 R31.2 | 168.34,182.55 153.96,182.55 | 153.96,182.55 R30.2 | 153.96,182.55 139.58,182.55 | 139.58,182.55 R29.2 | 139.58,182.55 125.29,182.55 | 125.29,182.55 R28.2 | 125.29,182.55 110.41,182.55 | 110.41,182.55 R27.2 | 110.41,182.55 96.03,182.55 | 96.03,182.55 R26.2 | 96.03,182.55 81.15,182.55 | 81.15,182.55 R25.2 | 81.15,182.55 66.77,182.55 | 66.77,182.55 R24.2 | 66.77,182.55 52.39,182.55 | 52.39,182.55 R23.2 | 52.39,182.55 38.01,182.55 R22.2
BUS_COLUMNAS1
  Top 1.422: IC1.28 50.53,24.53 50.55,24.55 43.05,24.55 38.8,28.8 38.8,197.8 35.8,200.8 32.85,200.8 R1.1
  Bottom 1.422: IC1.28 50.53,24.53 50.55,24.55
BUS_COLUMNAS2
  Top 1.422: IC1.27 53.07,52.28 53.05,52.3 53.05,198.8 50.8,201.05 R2.1
  Bottom 1.422: IC1.27 53.07,24.53 53.05,24.55
BUS_COLUMNAS3
  Top 1.422: IC1.26 55.61,24.49 55.55,24.55 55.55,29.3 57.55,31.3 64.05,31.3 67.8,35.05 67.8,198.8 65.8,200.8 62.15,200.8 R3.1
  Bottom 1.422: IC1.26 55.61,24.49 55.55,24.55
BUS_COLUMNAS4
  Top 1.422: IC1.25 58.15,24.45 58.05,24.55 58.05,28.55 58.55,29.05 68.05,29.05 70.55,31.55 79.3,31.55 82.3,34.55 82.3,199.3 80.55,201.05 76.93,201.05 R4.1
  Bottom 1.422: IC1.25 58.15,24.45 58.05,24.55
BUS_COLUMNAS5
  Top 1.422: IC1.24 60.69,24.41 60.55,24.55 60.55,26.05 61.05,26.55 68.8,26.55 71.3,29.05 80.3,29.05 82.55,31.3 94.05,31.3 96.8,34.05 96.8,199.3 95.3,200.8 91.39,200.8 R5.1
  Bottom 1.422: IC1.24 60.69,24.41 60.55,24.55
BUS_COLUMNAS6
  Top 1.422: 63.05,24.55 63.23,24.37 IC1.23 63.23,18.37 64.8,16.8 85.05,16.8 87.05,14.8 87.05,12.3 88.8,10.55 171.3,10.55 189.05,28.3 189.05,136.3 187.3,138.05 187.3,201.3 184.55,204.05 108.69,204.05 R6.1
  Bottom 1.422: IC1.23 63.23,24.37 63.05,24.55
BUS_COLUMNAS7
  Top 1.422: IC1.22 65.77,24.52 65.8,24.55 70.3,24.55 72.55,26.8 82.05,26.8 84.3,29.05 104.3,29.05 106.3,31.05 123.55,31.05 125.8,33.3 125.8,199.55 124.55,200.8 120.13,200.8 R7.1
  Bottom 1.422: IC1.22 65.77,24.52 65.8,24.55
BUS_COLUMNAS8  (1 unrouted)
  Bottom 1.422: IC1.18 75.93,24.17 75.8,24.3 | R8.1 138.45,200.95 138.55,201.05
BUS_COLUMNAS9  (1 unrouted)
  Bottom 1.422: IC1.17 78.47,24.13 78.3,24.3 | R9.1 153.28,200.82 153.3,200.8
BUS_COLUMNAS10  (1 unrouted)
  Bottom 1.422: IC1.16 81.01,24.09 80.8,24.3 | R10.1 167.66,200.94 167.8,200.8
BUS_COLUMNAS11
  Top 1.422: IC1.15 83.55,24.3 85.55,26.3 182.05,26.3 184.3,28.55 184.3,199.05 182.3,201.05 R11.1
  Bottom 1.422: IC1.15 83.55,24.3
BUS_FILAS1
  Bottom 1.422: IC1.2 53.07,11.07 51.55,9.55 14.55,9.55 5.3,18.8 5.3,173.55 7.3,175.55 9.62,175.55 R12.1
BUS_FILAS2  (1 unrouted)
  Bottom 1.422: IC1.3 55.61,10.11 55.55,10.05 | R13.1 9.55,156.3
BUS_FILAS3  (1 unrouted)
  Bottom 1.422: IC1.4 58.15,10.15 58.05,10.05 | R14.1 9.18,140.93 9.05,140.8
BUS_FILAS4  (1 unrouted)
  Bottom 1.422: IC1.5 60.69,10.16 60.8,10.05 | R15.1 9.56,124.81 9.55,124.8
BUS_FILAS5  (1 unrouted)
  Bottom 1.422: IC1.6 63.23,10.12 63.3,10.05 | R16.1 9.5,108.85 9.55,108.8
BUS_FILAS6  (1 unrouted)
  Bottom 1.422: IC1.7 65.77,10.08 65.8,10.05 | R17.1 9.63,92.63 9.55,92.55
BUS_FILAS7  (1 unrouted)
  Bottom 1.422: IC1.11 75.93,10.17 76.05,10.05 | R18.1 9.51,76.59 9.55,76.55
BUS_FILAS8  (1 unrouted)
  Bottom 1.422: IC1.12 78.47,10.13 78.55,10.05 | R19.1 9.64,60.64 9.55,60.55
BUS_FILAS9  (1 unrouted)
  Bottom 1.422: IC1.13 81.01,10.09 81.05,10.05 | R20.1 9.52,44.83 9.55,44.8
BUS_FILAS10  (1 unrouted)
  Bottom 1.422: IC1.14 83.55,10.05 | R21.1 9.65,28.65 9.55,28.55
COLUMNA_ANODOS_1
  Top 1.422: Q1.E 30.12,191.37 27.05,188.3 27.05,183.47 | 27.05,183.47 LED1.A | 27.05,183.47 27.05,167.62 | 27.05,167.62 LED12.A | 27.05,167.62 27.05,151.88 | 27.05,151.88 LED23.A | 27.05,151.88 27.05,135.78 | 27.05,135.78 LED34.A | 27.05,135.78 27.05,119.36 | 27.05,119.36 LED45.A | 27.05,119.36 27.05,87.86 | 27.05,87.86 LED67.A | 27.05,87.86 27.05,55.84 | 27.05,55.84 LED89.A | 27.05,55.84 27.05,39.75 LED100.A
COLUMNA_ANODOS_2
  Top 1.422: Q2.E 44.99,191.49 42.05,188.55 42.05,183.36 | 42.05,183.36 LED2.A | 42.05,183.36 42.05,166.78 | 42.05,166.78 LED13.A | 42.05,166.78 42.05,151.04 | 42.05,151.04 LED24.A | 42.05,151.04 42.05,135.44 | 42.05,135.44 LED35.A | 42.05,135.44 42.05,119.02 | 42.05,119.02 LED46.A | 42.05,119.02 42.05,87.52 | 42.05,87.52 LED68.A | 42.05,87.52 42.05,71.1 | 42.05,71.1 LED79.A | 42.05,71.1 42.05,55.5 | 42.05,55.5 LED90.A | 42.05,55.5 42.05,39.18 LED101.A
COLUMNA_ANODOS_3
  Top 1.422: Q3.E 58.99,191.49 56.55,189.05 56.55,183.25 | 56.55,183.25 LED3.A | 56.55,183.25 56.55,166.94 | 56.55,166.94 LED14.A | 56.55,166.94 56.55,151.2 | 56.55,151.2 LED25.A | 56.55,151.2 56.55,135.6 | 56.55,135.6 LED36.A | 56.55,135.6 56.55,119.18 | 56.55,119.18 LED47.A | 56.55,119.18 56.55,103.44 | 56.55,103.44 LED58.A | 56.55,103.44 56.55,87.68 | 56.55,87.68 LED69.A | 56.55,87.68 56.55,71.26 | 56.55,71.26 LED80.A | 56.55,71.26 56.55,55.16 | 56.55,55.16 LED91.A | 56.55,55.16 56.55,39.11 LED102.A
COLUMNA_ANODOS_4
  Top 1.422: Q4.E 74.31,191.31 71.05,188.05 71.05,183.14 | 71.05,183.14 LED4.A | 71.05,183.14 71.05,151.36 | 71.05,151.36 LED26.A | 71.05,151.36 71.05,135.76 | 71.05,135.76 LED37.A | 71.05,135.76 71.05,119.34 | 71.05,119.34 LED48.A | 71.05,119.34 71.05,103.6 | 71.05,103.6 LED59.A | 71.05,103.6 71.05,87.34 | 71.05,87.34 LED70.A | 71.05,87.34 71.05,70.92 | 71.05,70.92 LED81.A | 71.05,70.92 71.05,55.32 | 71.05,55.32 LED92.A | 71.05,55.32 71.05,38.99 LED103.A
COLUMNA_ANODOS_5
  Top 1.422: Q5.E 88.65,191.4 85.3,188.05 85.3,167.35 | 85.3,167.35 LED16.A | 85.3,167.35 85.3,151.77 | 85.3,151.77 LED27.A | 85.3,151.77 85.3,119.75 | 85.3,119.75 LED49.A | 85.3,119.75 85.3,104.01 | 85.3,104.01 LED60.A | 85.3,104.01 85.3,71.33 | 85.3,71.33 LED82.A | 85.3,71.33 85.3,55.73 | 85.3,55.73 LED93.A | 85.3,55.73 85.3,39.17 LED104.A
COLUMNA_ANODOS_6
  Top 1.422: Q6.E 103.09,191.34 100.05,188.3 100.05,183.03 | 100.05,183.03 LED6.A | 100.05,183.03 100.05,166.76 | 100.05,166.76 LED17.A | 100.05,166.76 100.05,151.18 | 100.05,151.18 LED28.A | 100.05,151.18 100.05,135.92 | 100.05,135.92 LED39.A | 100.05,135.92 100.05,119.16 | 100.05,119.16 LED50.A | 100.05,119.16 100.05,103.92 | 100.05,103.92 LED61.A | 100.05,103.92 100.05,87.5 | 100.05,87.5 LED72.A | 100.05,87.5 100.05,71.74 | 100.05,71.74 LED83.A | 100.05,71.74 100.05,55.14 | 100.05,55.14 LED94.A | 100.05,55.14 100.05,38.85 LED105.A
COLUMNA_ANODOS_7
  Top 1.422: Q7.E 117.4,191.4 114.3,188.3 114.3,183.27 | 114.3,183.27 LED7.A | 114.3,183.27 114.3,167.17 | 114.3,167.17 LED18.A | 114.3,167.17 114.3,151.59 | 114.3,151.59 LED29.A | 114.3,151.59 114.3,136.33 | 114.3,136.33 LED40.A | 114.3,136.33 114.3,119.57 | 114.3,119.57 LED51.A | 114.3,119.57 114.3,87.91 | 114.3,87.91 LED73.A | 114.3,87.91 114.3,71.65 | 114.3,71.65 LED84.A | 114.3,71.65 114.3,55.19 | 114.3,55.19 LED95.A | 114.3,55.19 114.3,39.03 LED106.A
COLUMNA_ANODOS_8
  Top 1.422: Q8.E 132.37,191.37 129.05,188.05 129.05,182.91 | 129.05,182.91 LED8.A | 129.05,182.91 129.05,167.08 | 129.05,167.08 LED19.A | 129.05,167.08 129.05,151 | 129.05,151 LED30.A | 129.05,151 129.05,135.74 | 129.05,135.74 LED41.A | 129.05,135.74 129.05,119.62 | 129.05,119.62 LED52.A | 129.05,119.62 129.05,103.58 | 129.05,103.58 LED63.A | 129.05,103.58 129.05,87.82 | 129.05,87.82 LED74.A | 129.05,87.82 129.05,71.56 | 129.05,71.56 LED85.A | 129.05,71.56 129.05,55.1 | 129.05,55.1 LED96.A | 129.05,55.1 129.05,39.21 LED107.A
COLUMNA_ANODOS_9
  Top 1.422: Q9.E 146.65,191.4 143.3,188.05 143.3,183.05 | 143.3,183.05 LED9.A | 143.3,183.05 143.3,151.41 | 143.3,151.41 LED31.A | 143.3,151.41 143.3,135.79 | 143.3,135.79 LED42.A | 143.3,135.79 143.3,119.53 | 143.3,119.53 LED53.A | 143.3,119.53 143.3,103.99 | 143.3,103.99 LED64.A | 143.3,103.99 143.3,88.23 | 143.3,88.23 LED75.A | 143.3,88.23 143.3,72.11 | 143.3,72.11 LED86.A | 143.3,72.11 143.3,55.51 | 143.3,55.51 LED97.A | 143.3,55.51 143.3,39.39 LED108.A
COLUMNA_ANODOS_10
  Top 1.422: Q10.E 157.8,188.05 157.8,183.05 | 157.8,183.05 LED10.A | 157.8,183.05 157.8,151.71 | 157.8,151.71 LED32.A | 157.8,151.71 157.8,135.95 | 157.8,135.95 LED43.A | 157.8,135.95 157.8,104.15 | 157.8,104.15 LED65.A | 157.8,104.15 157.8,88.03 | 157.8,88.03 LED76.A | 157.8,88.03 157.8,71.77 | 157.8,71.77 LED87.A | 157.8,71.77 157.8,55.67 | 157.8,55.67 LED98.A | 157.8,55.67 157.8,38.82 LED109.A
COLUMNA_ANODOS_11
  Top 1.422: Q11.E 176.04,191.29 172.8,188.05 172.8,183.21 | 172.8,183.21 LED11.A | 172.8,183.21 172.8,151.87 | 172.8,151.87 LED33.A | 172.8,151.87 172.8,103.45 | 172.8,103.45 LED66.A | 172.8,103.45 172.8,87.69 | 172.8,87.69 LED77.A | 172.8,87.69 172.8,71.43 | 172.8,71.43 LED88.A | 172.8,71.43 172.8,55.83 | 172.8,55.83 LED99.A | 172.8,55.83 172.8,38.75 LED110.A
FILA_CATODOS_1
  Bottom 1.422: Q12.C 29.97,178.01 LED1.K 44.99,177.88 LED2.K 59.49,177.77 LED3.K 73.99,177.66 LED4.K 102.99,177.55 LED6.K 117.59,177.44 LED7.K 132.07,177.35 LED8.K 146.57,177.24 LED9.K 160.74,177.13 LED10.K 175.8,177.35 LED11.K
FILA_CATODOS_2
  Bottom 1.422: Q13.C 30.19,161.4 LED12.K 44.62,161.67 LED13.K 59.3,161.33 LED14.K 88.3,161.49 LED16.K 102.62,161.65 LED17.K 117.3,161.31 LED18.K 131.8,161.47 LED19.K
FILA_CATODOS_3
  Bottom 1.422: Q14.C 30.48,145.79 LED23.K 44.7,145.85 LED24.K 59.38,145.51 LED25.K 73.88,145.67 LED26.K 88.38,145.83 LED27.K 102.7,145.99 LED28.K 117.38,145.65 LED29.K 131.7,145.81 LED30.K 146.38,145.47 LED31.K 160.9,145.63 LED32.K 175.96,145.85 LED33.K
FILA_CATODOS_4
  Bottom 1.422: Q15.C 30.4,129.89 LED34.K 44.96,129.67 LED35.K 59.46,129.83 LED36.K 73.96,129.99 LED37.K 102.96,130.15 LED39.K 117.46,130.31 LED40.K 131.78,130.47 LED41.K 146.42,130.13 LED42.K 161.04,129.85 LED43.K
FILA_CATODOS_5
  Bottom 1.422: Q16.C 30.09,113.78 LED45.K 44.54,113.67 LED46.K 59.04,113.83 LED47.K 73.86,113.99 LED48.K 88.54,113.65 LED49.K 102.86,113.81 LED50.K 117.54,113.47 LED51.K 132.06,113.63 LED52.K 146.44,113.85 LED53.K
FILA_CATODOS_6
  Bottom 1.422: Q17.C LED58.K 74.12,97.67 LED59.K 88.62,97.83 LED60.K 103.12,97.99 LED61.K 131.94,98.15 LED63.K 146.62,97.81 LED64.K 161.12,97.97 LED65.K 175.58,98.13 LED66.K
FILA_CATODOS_7
  Bottom 1.422: Q18.C 29.91,81.56 LED67.K 44.7,82.01 LED68.K 59.2,82.17 LED69.K 73.52,82.33 LED70.K 103.02,81.99 LED72.K 117.7,81.65 LED73.K 132.2,81.81 LED74.K 146.7,81.97 LED75.K 161.16,82.13 LED76.K 175.78,81.85 LED77.K
FILA_CATODOS_8
  Bottom 1.422: Q19.C 44.72,65.45 LED79.K 59.28,65.67 LED80.K 73.6,65.83 LED81.K 88.28,65.49 LED82.K 103.28,65.65 LED83.K 117.28,65.81 LED84.K 132.1,65.97 LED85.K 146.8,65.63 LED86.K 160.86,65.85 LED87.K 175.68,66.01 LED88.K
FILA_CATODOS_9
  Bottom 1.422: Q20.C LED89.K 44.86,49.83 LED90.K 59.18,49.99 LED91.K 73.86,49.65 LED92.K 88.36,49.81 LED93.K 102.68,49.97 LED94.K 117.32,49.63 LED95.K 131.94,49.35 LED96.K 146.44,49.51 LED97.K 160.94,49.67 LED98.K 175.94,49.83 LED99.K
FILA_CATODOS_10
  Bottom 1.422: Q21.C LED100.K 44.96,33.73 LED101.K 59.46,33.66 LED102.K 73.85,33.59 LED103.K 88.31,33.62 LED104.K 102.81,33.55 LED105.K 117.31,33.48 LED106.K 132.31,33.41 LED107.K 146.81,33.34 LED108.K 160.81,33.27 LED109.K 175.81,33.2 LED110.K
GNDA  (via drill 0.6 pad 1.42)
  Top 1.422: v68.3,10.05 68.3,9.3 67.05,8.05 26.55,8.05 19.05,15.55 19.05,28.61 Q21.E 19.24,28.8 22.05,28.8 23.55,30.3 23.55,46.05 | Q12.E 19.42,172.93 23.55,168.8 23.55,157.55 | 23.55,157.55 22.3,156.3 19.22,156.3 Q13.E | 23.55,157.55 23.55,142.3 | 23.55,142.3 22.05,140.8 18.79,140.8 Q14.E | 23.55,142.3 23.55,126.55 | 23.55,126.55 21.8,124.8 Q15.E | 23.55,126.55 23.55,110.55 | 23.55,110.55 21.8,108.8 19.19,108.8 Q16.E | 23.55,110.55 23.55,94.05 | 23.55,94.05 22.05,92.55 19.13,92.55 Q17.E | 23.55,94.05 23.55,77.8 | 23.55,77.8 22.3,76.55 19.16,76.55 Q18.E | 23.55,77.8 23.55,61.55 | Q19.E 19.16,60.3 22.3,60.3 23.55,61.55 | 23.55,61.55 23.55,46.05 | 23.55,46.05 22.3,44.8 19.13,44.8 Q20.E
  Bottom 1.422: JP1.1 195.4,196.9 193.8,195.3 193.8,179.55 C1.- 193.89,178.96 IC2.2 193.8,172.17 193.8,168.05 202.3,159.05 202.3,16.8 200.05,14.55 195.86,14.55 PULSADOR.1 191.24,14.49 184.8,8.05 102.05,8.05 101.05,9.05 | IC1.8 v68.31,10.06 v68.3,10.05 68.3,9.55 69.8,8.05 100.05,8.05 101.05,9.05 | IC1.19 73.39,25.64 74.3,26.55 96.55,26.55 101.05,22.05 101.05,19.23 C4.2 101.07,14.29 C5.2 101.05,14.15 101.05,9.05
N$1
  Bottom 1.422: R32.1 180.8,185.3 181.3,185.8 181.3,191.22 Q11.C
N$2
  Bottom 1.422: R31.1 165.84,185.09 166.3,185.55 166.3,191.33 Q10.C
N$3
  Bottom 1.422: R30.1 151.3,185.05 151.8,185.55 151.8,191.36 Q9.C
N$4
  Bottom 1.422: R29.1 136.85,184.85 137.55,185.55 137.55,191.3 Q8.C
N$5  (via drill 0.6 pad 1.42)
  other vias: 50.55,24.55
N$6
  Bottom 1.422: R28.1 122.45,191.29 Q7.C
N$7
  Bottom 1.422: R27.1 107.95,191.18 Q6.C
N$8
  Bottom 1.422: R26.1 93.45,191.07 Q5.C
N$9
  Bottom 1.422: R25.1 78.95,190.96 Q4.C
N$10
  Bottom 1.422: R24.1 64.45,191.46 Q3.C
N$11
  Bottom 1.422: R23.1 49.95,191.35 Q2.C
N$12
  Bottom 1.422: R22.1 35.45,191.24 Q1.C
N$13
  Bottom 1.422: R1.2 32.73,191.56 Q1.B
N$14
  Bottom 1.422: R2.2 47.48,191.56 Q2.B
N$15  (via drill 0.6 pad 1.42)
  other vias: 53.05,24.55
N$16
  Bottom 1.422: R3.2 62.1,191.65 Q3.B
N$17
  Bottom 1.422: R4.2 Q4.B
N$18
  Bottom 1.422: R5.2 91.35,191.51 Q5.B
N$19
  Bottom 1.422: R6.2 105.6,191.43 Q6.B
N$20  (via drill 0.6 pad 1.42)
  other vias: 55.55,24.55
N$21  (via drill 0.6 pad 1.42)
  other vias: 58.05,24.55
N$22  (via drill 0.6 pad 1.42)
  other vias: 60.55,24.55
N$23
  Bottom 1.422: R7.2 120.1,191.48 Q7.B
N$24
  Bottom 1.422: R8.2 134.85,191.46 Q8.B
N$25
  Bottom 1.422: R9.2 149.35,191.45 Q9.B
N$26
  Bottom 1.422: R10.2 163.85,191.56 Q10.B
N$27
  Bottom 1.422: R11.2 178.6,191.42 Q11.B
N$28
  Bottom 1.422: R12.2 19.07,175.6 Q12.B
N$29
  Bottom 1.422: R13.2 Q13.B
N$30
  Bottom 1.422: R14.2 18.6,143.35 Q14.B
N$31
  Bottom 1.422: R15.2 Q15.B
N$32
  Bottom 1.422: R16.2 19.05,111.2 Q16.B
N$33
  Bottom 1.422: R17.2 19.02,95.2 Q17.B
N$34
  Bottom 1.422: R18.2 19.02,78.95 Q18.B
N$35
  Bottom 1.422: R19.2 19.05,62.95 Q19.B
N$36
  Bottom 1.422: R20.2 18.94,47.45 Q20.B
N$37
  Bottom 1.422: R21.2 Q21.B
N$38  (via drill 0.6 pad 1.42)
  other vias: 63.05,24.55
N$39  (via drill 0.6 pad 1.42)
  other vias: 65.8,24.55
N$40  (via drill 0.6 pad 1.42)
  other vias: 138.55,201.05
N$41  (via drill 0.6 pad 1.42)
  other vias: 153.3,200.8
N$42  (via drill 0.6 pad 1.42)
  other vias: 75.8,24.3
N$43  (via drill 0.6 pad 1.42)
  other vias: 78.3,24.3
N$44  (via drill 0.6 pad 1.42)
  other vias: 80.8,24.3
N$45  (via drill 0.6 pad 1.42)
  other vias: 83.55,24.3
N$46  (via drill 0.6 pad 1.42)
  other vias: 83.55,10.05
N$47  (via drill 0.6 pad 1.42)
  other vias: 81.05,10.05
N$48  (via drill 0.6 pad 1.42)
  other vias: 78.55,10.05
N$49  (via drill 0.6 pad 1.42)
  other vias: 76.05,10.05
N$50
  Bottom 1.422: C4.1 98.33,19.41 Q22.2 91.11,18.3 72.8,18.3 70.8,16.3 70.8,14.39 IC1.9
N$51  (via drill 0.6 pad 1.42)
  other vias: 167.8,200.8
N$52  (via drill 0.6 pad 1.42)
  other vias: 65.8,10.05
N$53  (via drill 0.6 pad 1.42)
  other vias: 63.3,10.05
N$54  (via drill 0.6 pad 1.42)
  other vias: 60.8,10.05
N$55  (via drill 0.6 pad 1.42)
  other vias: 58.05,10.05
N$56  (via drill 0.6 pad 1.42)
  other vias: 9.55,44.8
N$57  (via drill 0.6 pad 1.42)
  other vias: 9.55,28.55
N$58  (via drill 0.6 pad 1.42)
  other vias: 9.55,60.55
N$59  (via drill 0.6 pad 1.42)
  other vias: 9.55,76.55
N$60  (via drill 0.6 pad 1.42)
  other vias: 9.55,92.55
N$61  (via drill 0.6 pad 1.42)
  other vias: 9.55,108.8
N$62  (via drill 0.6 pad 1.42)
  other vias: 9.55,124.8
N$63  (via drill 0.6 pad 1.42)
  other vias: 9.05,140.8
N$64  (via drill 0.6 pad 1.42)
  other vias: 9.55,156.3
N$77
  Bottom 1.422: D1.A 35.46,18.51 R33.2
N$78
  Bottom 1.422: C5.1 98.33,14.33 Q22.1 89.27,14.33 87.3,16.3 73.8,16.3 73.3,15.8 73.3,14.43 IC1.10
N$79
  Bottom 1.422: D1.C 44.98,14.12 45.8,13.3 50.49,13.3 IC1.1
N$80
  Bottom 1.422: D2.A 198.62,194.23 JP1.2
N$81
  Bottom 1.422: D2.C 198.62,174.45 IC2.1
N$82  (via drill 0.6 pad 1.42)
  other vias: 55.55,10.05
PULSADOR_SET
  Bottom 1.422: IC1.21 68.31,28.06 71.8,31.3 104.3,31.3 112.55,23.3 188.98,23.3 R34.2 194.68,23.23 PULSADOR.2

### Text on the board
Top: RELOJ CON PALABRAS / Israel Uribe / Abril 2020